# Altium schematic sheet S01-INTERFACES.SchDoc
size B; SheetNumber: 2; SheetTotal: 5; BLOCK-TITLE: AUDIO MODULE INTERFACES AND GPIO EXPANSION; BLOCK-SIZE: B; BLOCK-PROJECT: MULTIMOD AUDIO MODULE; BLOCK-REVISION: 1; BLOCK-ORGANIZATION: UNIVERSITY OF FLORIDA; BLOCK-DESIGNER: MEHRON TALEBI; BLOCK-IDENTIFIER: SUMMER 2023; BLOCK-REVIEWER: MIKE STAPLETON
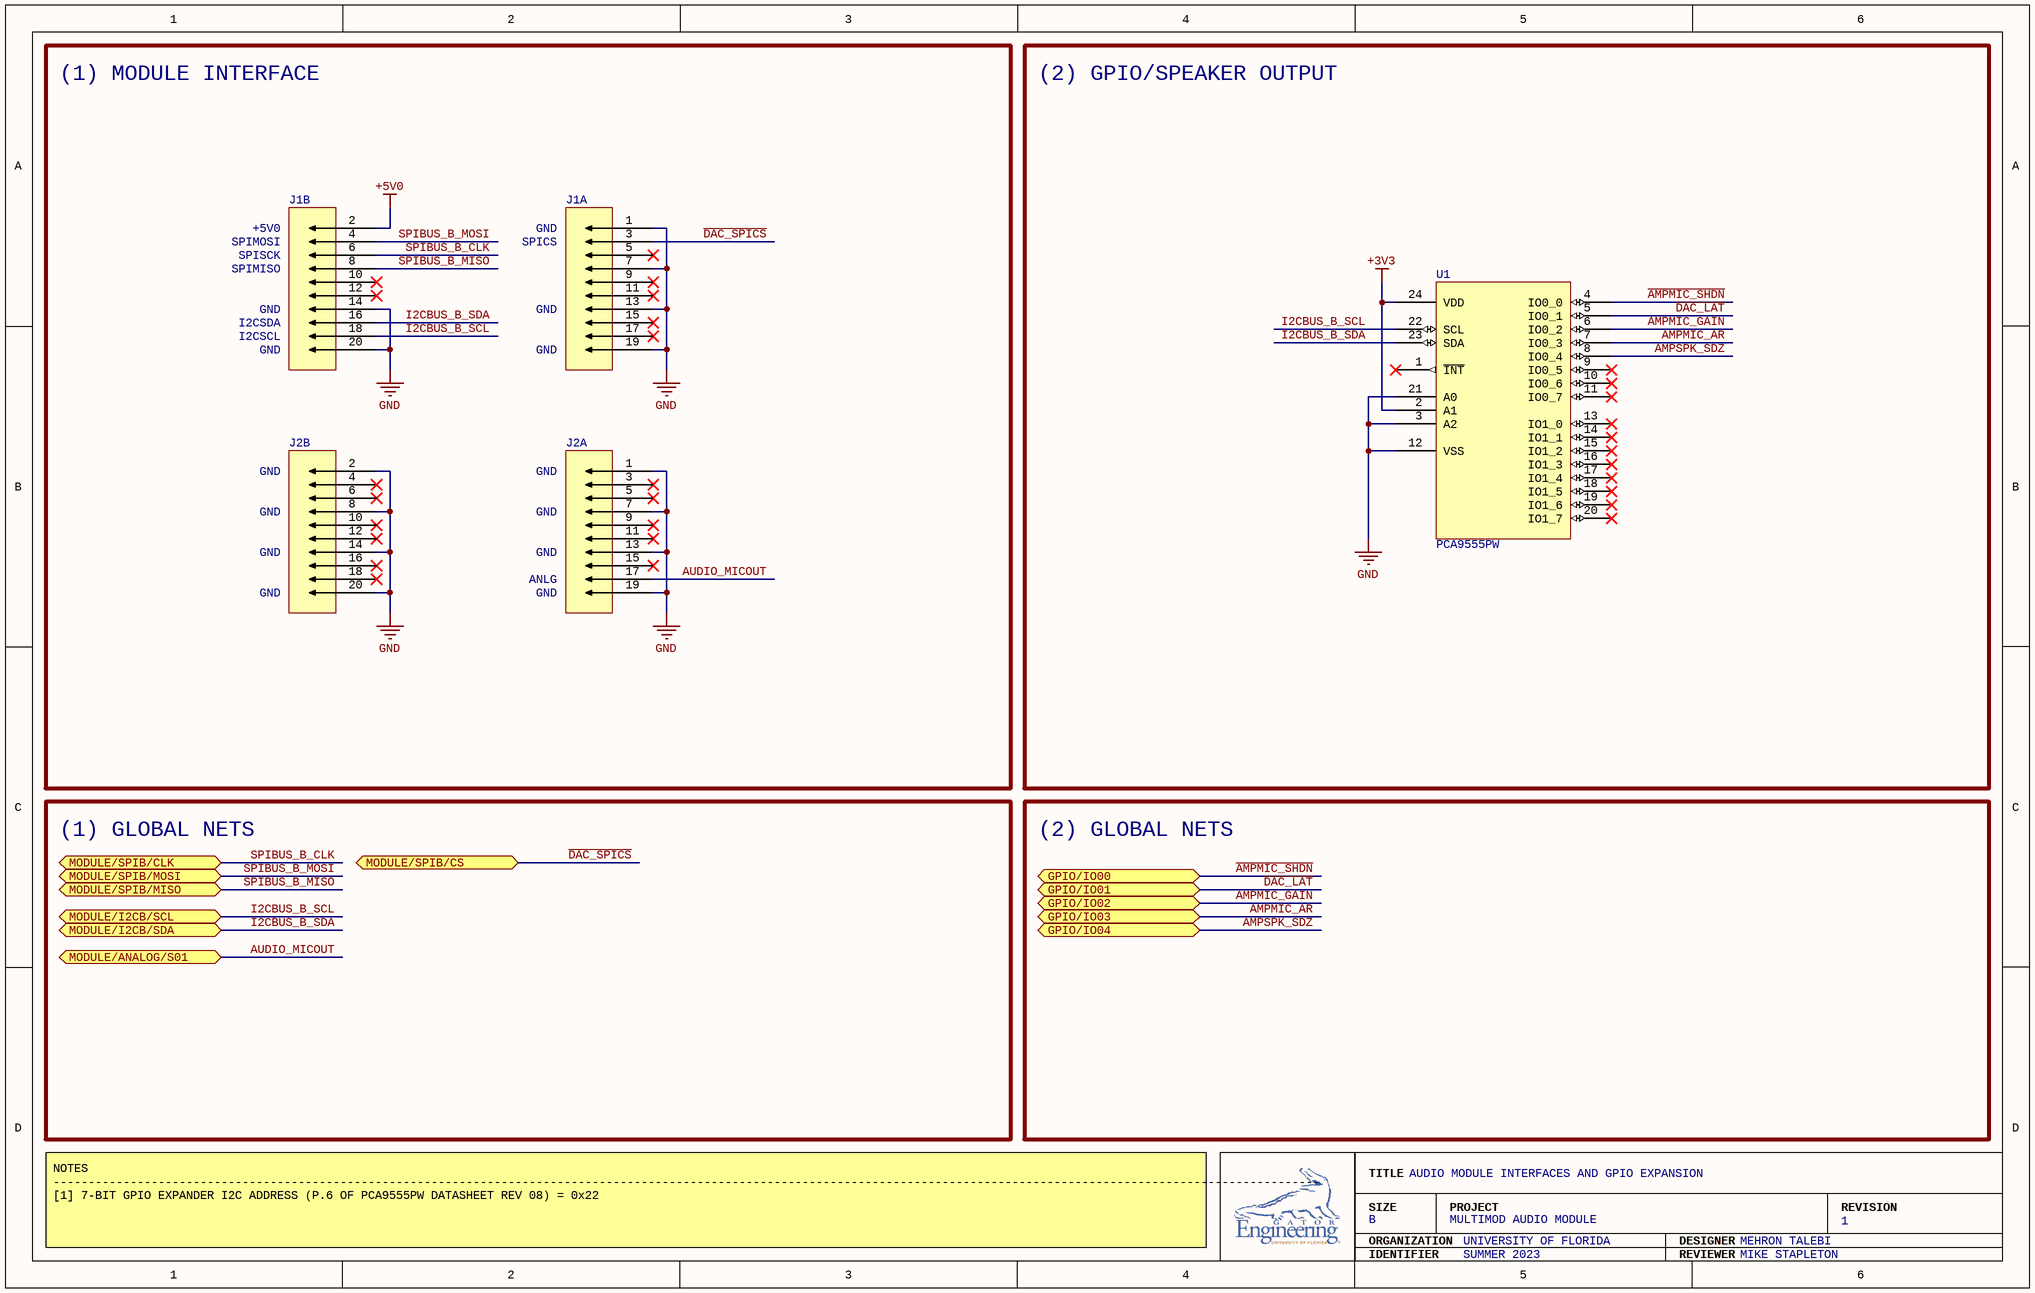
[diagram p0: S01-INTERFACES.SchDoc]

## Parts
J1  NPTC102KFMS-RC  [NPTC102KFMS-RC]  (value not drawn)  (parts A,B of 2)
J2  NPTC102KFMS-RC  [NPTC102KFMS-RC]  (value not drawn)  (parts A,B of 2)
U1  PCA9555PW  [PCA9555PW]

## Blocks framed on the sheet
(1) MODULE INTERFACE: J1 J2
(2) GPIO/SPEAKER OUTPUT: U1

## Ports
GPIO/IO00 (bidir), GPIO/IO01 (bidir), GPIO/IO02 (bidir), GPIO/IO03 (bidir), GPIO/IO04 (bidir), MODULE/ANALOG/S01 (bidir), MODULE/I2CB/SCL (bidir), MODULE/I2CB/SDA (bidir), MODULE/SPIB/CLK (bidir), MODULE/SPIB/CS (bidir), MODULE/SPIB/MISO (bidir), MODULE/SPIB/MOSI (bidir)

## Nets
+3V3: U1.2(A1) U1.24(VDD)
+5V0: J1.2
GND: J1.1 J1.7 J1.13 J1.14 J1.19 J1.20 J2.1 J2.2 J2.7 J2.8 J2.13 J2.14 J2.19 J2.20 U1.3(A2) U1.12(VSS) U1.21(A0)
~{AMPMIC_SHDN}: U1.4(IO0_0) ; port GPIO/IO00
~{DAC_LAT}: U1.5(IO0_1) ; port GPIO/IO01
~{DAC_SPICS}: J1.3 ; port MODULE/SPIB/CS
AMPMIC_AR: U1.7(IO0_3) ; port GPIO/IO03
AMPMIC_GAIN: U1.6(IO0_2) ; port GPIO/IO02
AMPSPK_SDZ: U1.8(IO0_4) ; port GPIO/IO04
AUDIO_MICOUT: J2.17 ; port MODULE/ANALOG/S01
I2CBUS_B_SCL: J1.18 U1.22(SCL) ; port MODULE/I2CB/SCL
I2CBUS_B_SDA: J1.16 U1.23(SDA) ; port MODULE/I2CB/SDA
SPIBUS_B_CLK: J1.6 ; port MODULE/SPIB/CLK
SPIBUS_B_MISO: J1.8 ; port MODULE/SPIB/MISO
SPIBUS_B_MOSI: J1.4 ; port MODULE/SPIB/MOSI

Not connected (* = marked no-connect by the designer): J1 5* 9* 10* 11* 12* 15* 17*; J2 3* 4* 5* 6* 9* 10* 11* 12* 15* 16* 18*; U1 1(~{INT})* 9(IO0_5)* 10(IO0_6)* 11(IO0_7)* 13(IO1_0)* 14(IO1_1)* 15(IO1_2)* 16(IO1_3)* 17(IO1_4)* 18(IO1_5)* 19(IO1_6)* 20(IO1_7)*

## Notes on the sheet
- +5V0
- SPIMOSI
- SPICS
- GND
- SPISCK
- SPIMISO
- I2CSCL
- I2CSDA
- ANLG
- (1) GLOBAL NETS
- (2) GLOBAL NETS
- NOTES
  -------------------------------------------------------------------------------------------------------------------------------------------------------------------------------------
  [1] 7-BIT GPIO EXPANDER I2C ADDRESS (P.6 OF PCA9555PW DATASHEET REV 08) = 0x22
- TITLE
- SIZE
- ORGANIZATION
- PROJECT
- DESIGNER
- REVISION
- IDENTIFIER
- REVIEWER

## Library data of the parts
J1 J2 = NPTC102KFMS-RC: CONN HDR 20POS 0.1 TIN SMD; Connector Type: Header; Style: Board to Board; Number of Positions: 20; Number of Positions Loaded: All; Pitch - Mating: 0.100" (2.54mm); Material Flammability Rating: UL94 V-0; Current Rating (Amps): 3A; Voltage Rating: 250V; System: Connector; Contact Type: Female Socket; Number of Rows: 2; Row Spacing - Mating: 0.100" (2.54mm); Mounting Type: Surface Mount; Termination: Solder; Fastening Type: Push-Pull; Contact Finish - Mating: Tin; Insulation Color: Black; Insulation Height: 0.299" (7.60mm); Operating Temperature: -40°C ~ 125°C; Contact Finish - Post: Tin; Insulation Material: Polyamide (PA6T), Nylon 6T; Contact Shape: Square; Contact Material: Phosphor Bronze; Supplier 1: Digi-Key; Supplier Part Number 1: S5680-ND
U1 = PCA9555PW: IC XPND 400KHZ I2C SMBUS 24TSSOP; Number of I/O: 16; Interface: I²C, SMBus; Interrupt Output: Yes; Output Type: Push-Pull; Current - Output Source/Sink: 10mA, 25mA; Voltage - Supply: 2.3V ~ 5.5V; Features: POR; Clock Frequency: 400 kHz; Operating Temperature: -40°C ~ 85°C; Mounting Type: Surface Mount; Package / Case: 24-TSSOP (0.173", 4.40mm Width); Supplier Device Package: 24-TSSOP; Supplier 1: Newark; Supplier Part Number 1: 24AC9600